# Altium project SCOM_SENSOR_HAT.PrjPcb
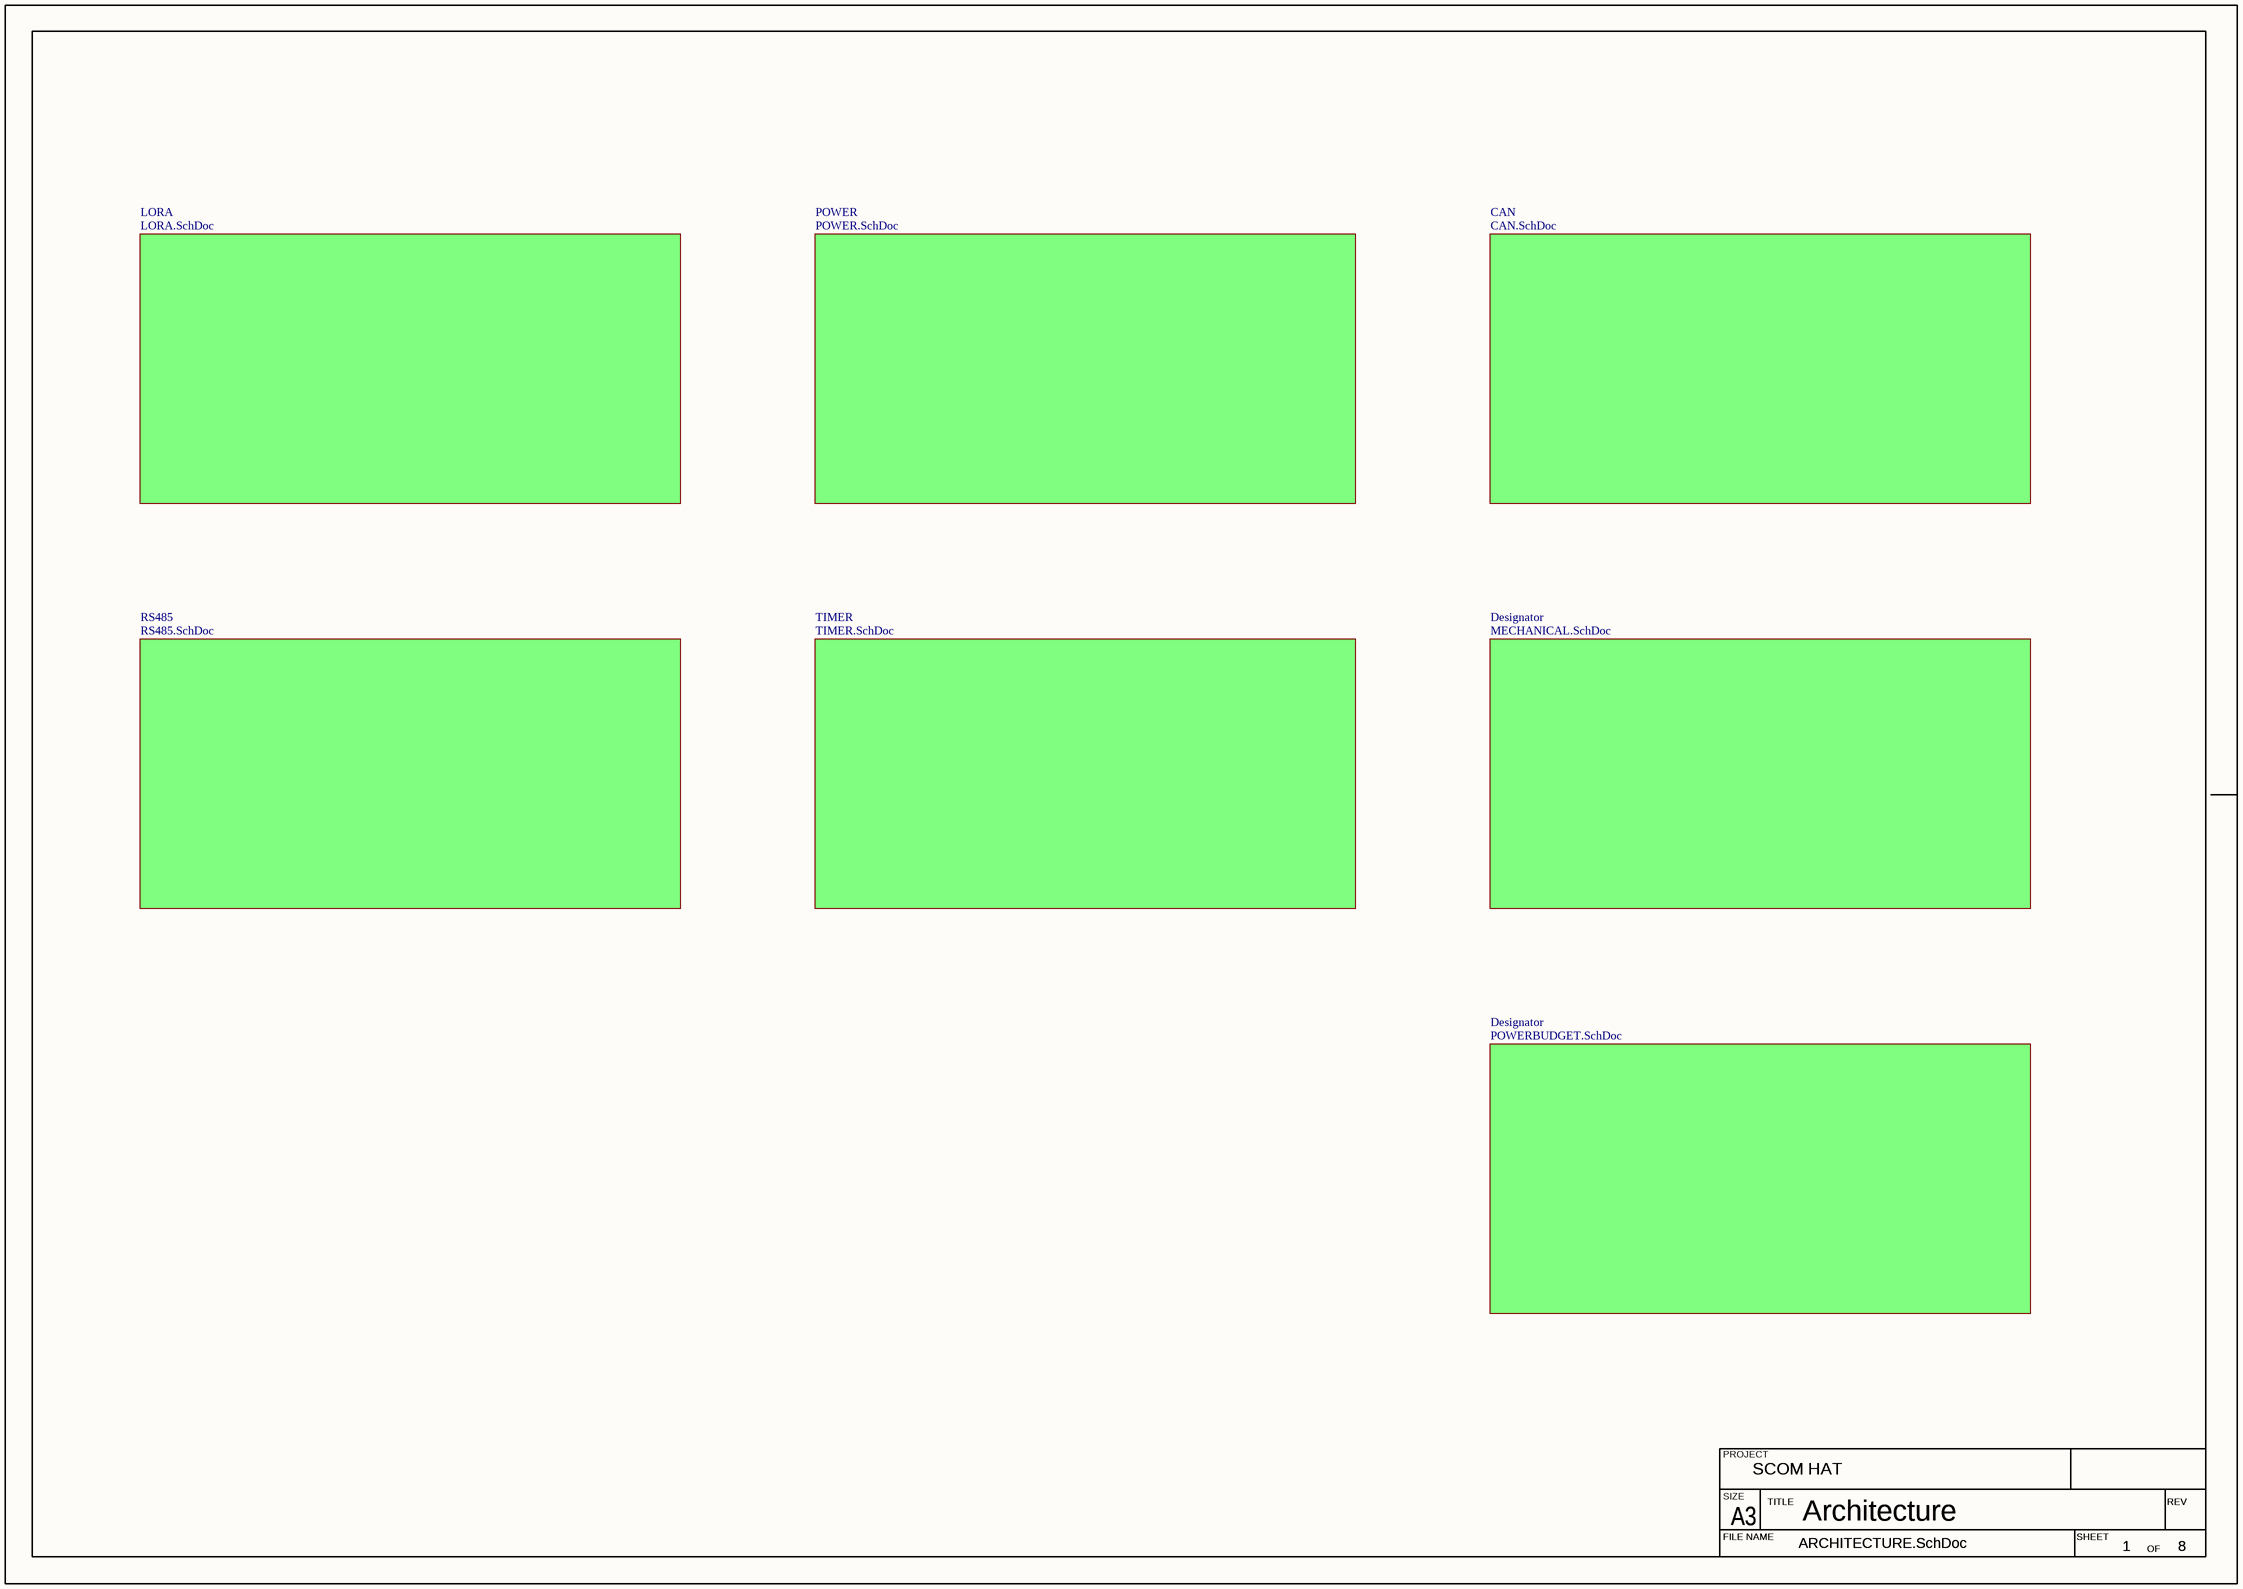
[diagram p0: ARCHITECTURE.SchDoc]
Project: SCOM HAT; Rev: 1.0; SheetTotal: 8
8 sheets, 74 parts. Net scope: global (net labels, ports and power ports of the same name join across sheets).
Board file: SCOM_SENSOR_HAT.PcbDoc
Sheets:
  ARCHITECTURE.SchDoc
    TIMER = TIMER.SchDoc
    POWER = POWER.SchDoc
    Designator = MECHANICAL.SchDoc
    RS485 = RS485.SchDoc
    LORA = LORA.SchDoc
    CAN = CAN.SchDoc
    Designator = POWERBUDGET.SchDoc

## Sheet ARCHITECTURE.SchDoc: Architecture
size 420 x 297 mm; Revision: 1.0; SheetNumber: 1

### Sub-sheets
CAN = CAN.SchDoc: no entries
Designator = MECHANICAL.SchDoc: no entries
Designator = POWERBUDGET.SchDoc: no entries
LORA = LORA.SchDoc: no entries
POWER = POWER.SchDoc: no entries
RS485 = RS485.SchDoc: no entries
TIMER = TIMER.SchDoc: no entries

### Notes on the sheet
- PROJECT
- SIZE
- FILE NAME
- A3
- TITLE
- SHEET
- OF
- REV

## Sheet TIMER.SchDoc: RV3028 Timer IC
size 420 x 297 mm; Revision: 1.0; SheetNumber: 3
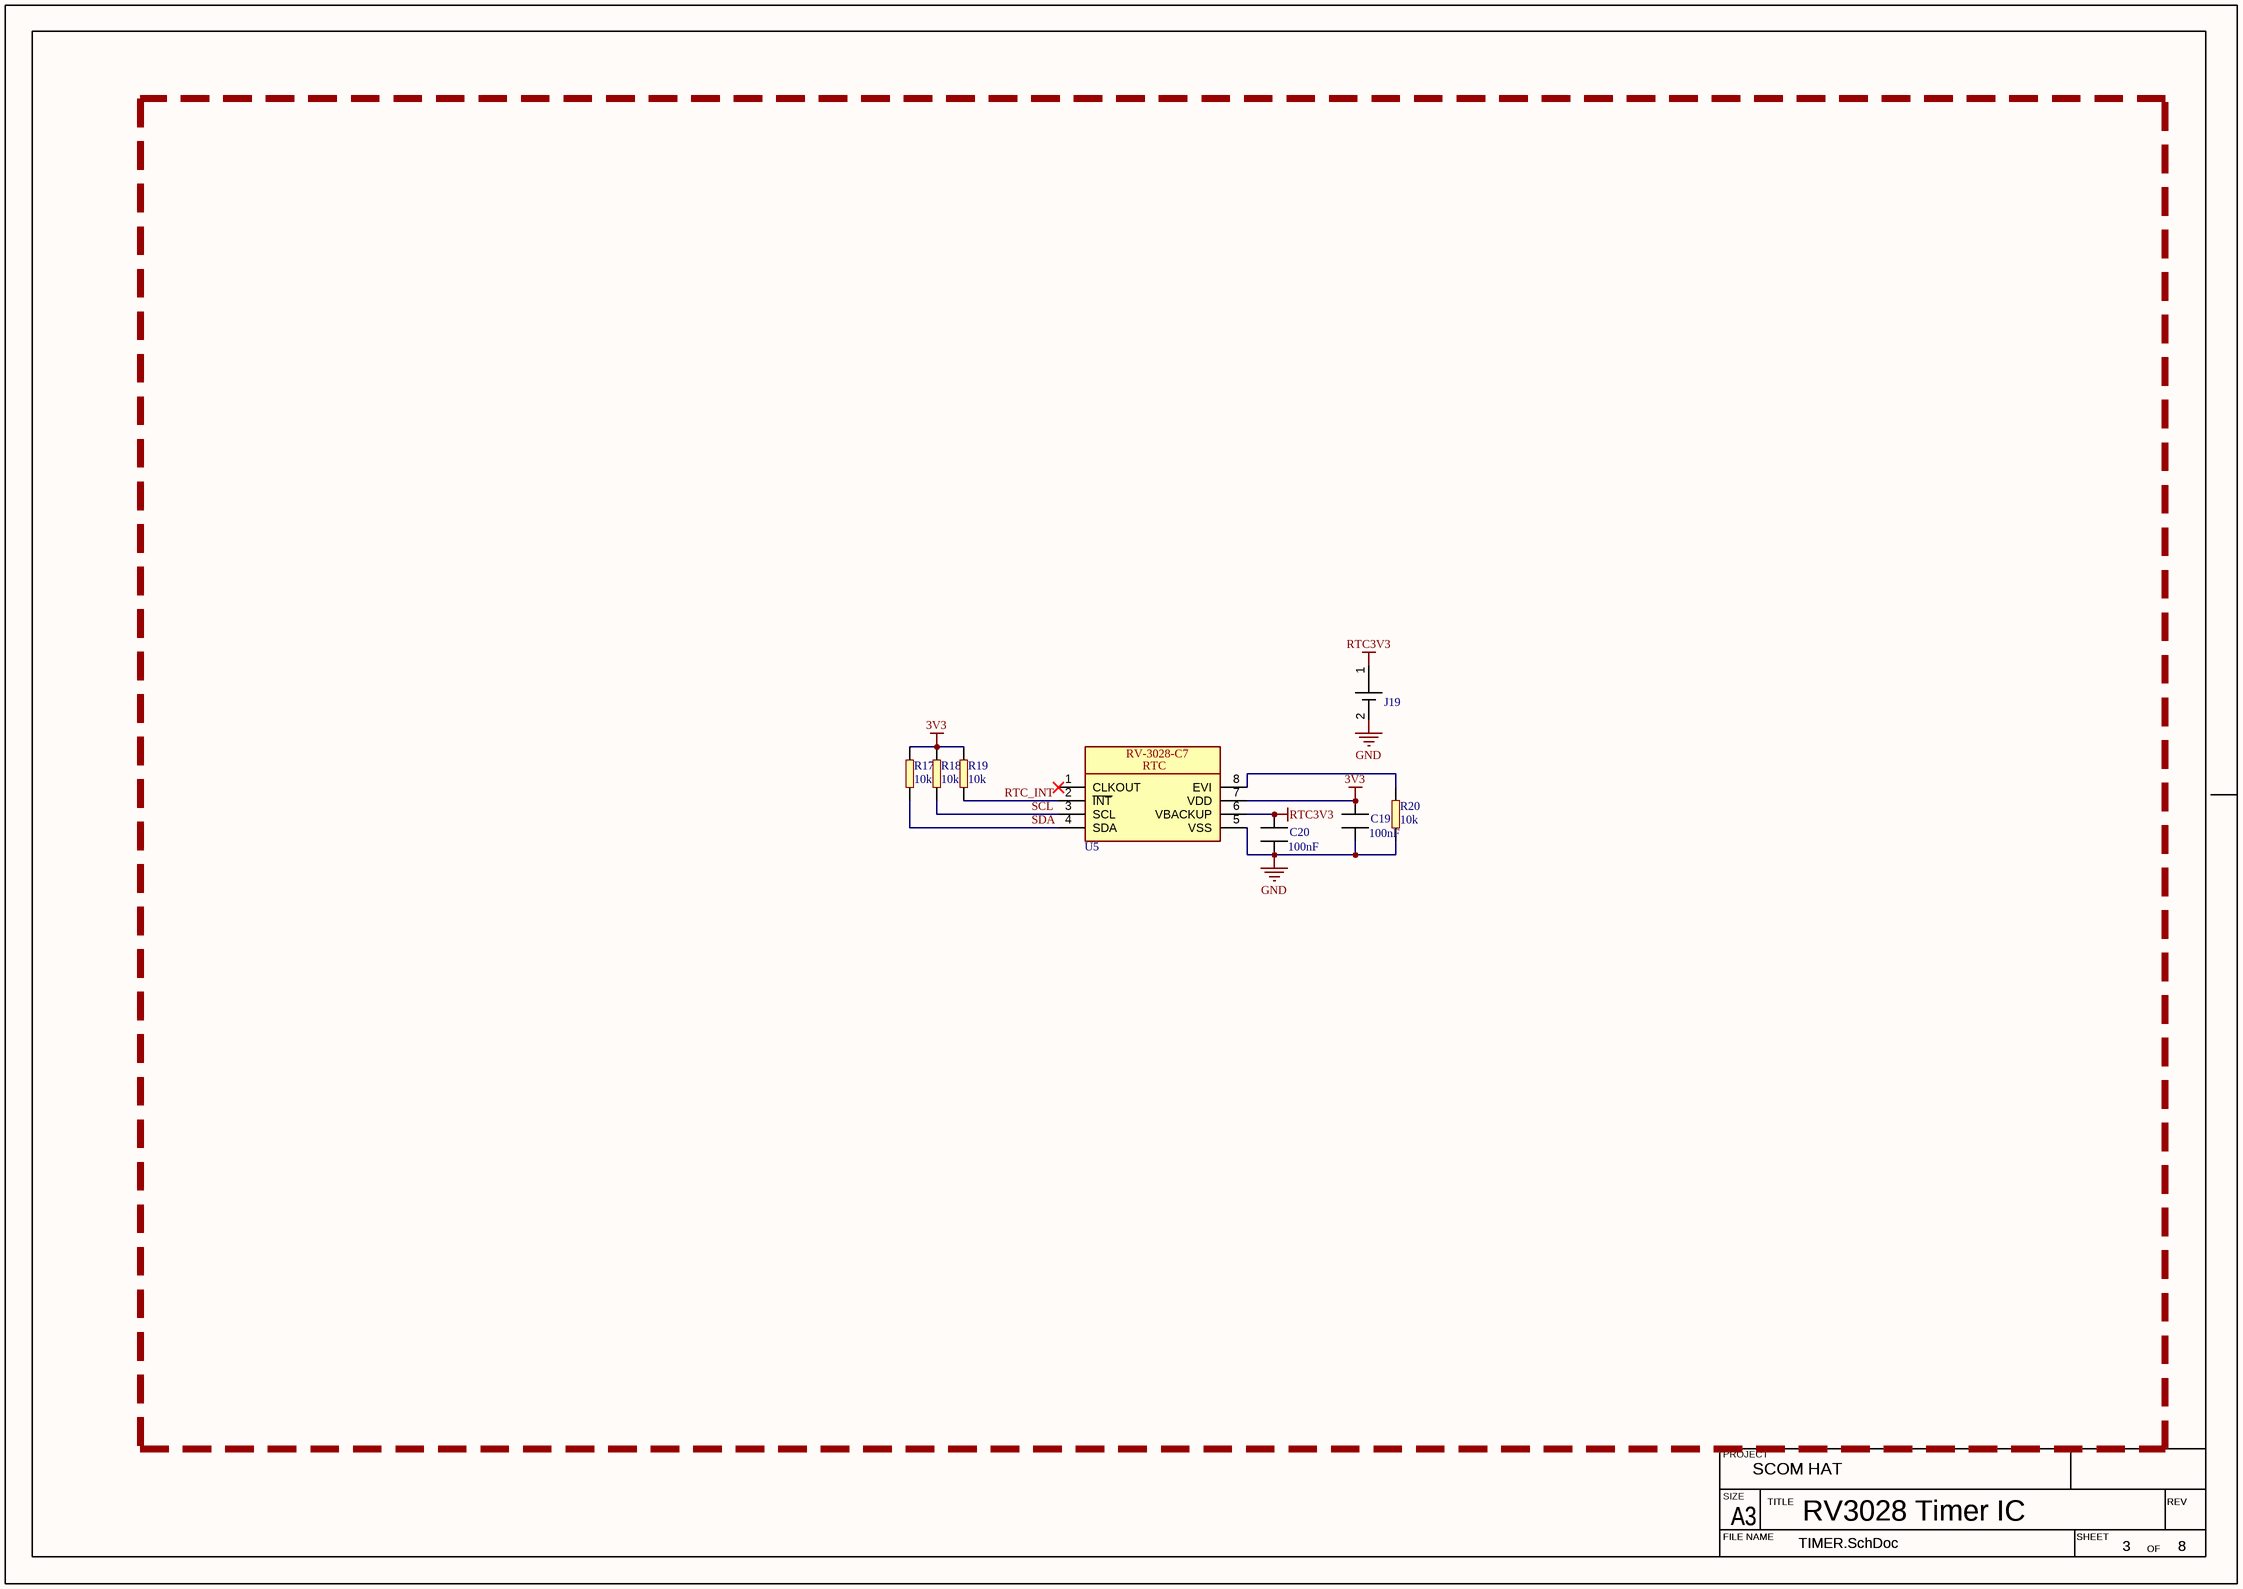
[diagram p1: TIMER.SchDoc]

### Parts
C19  value 100nF  [CAPC2012X13L]  (hidden comment: MLCC_0805)
C20  value 100nF  [CAPC2012X13L]  (hidden comment: MLCC_0805)
J19  CR1220-BH  [CR1220-BH]  (value not drawn)
R17  value 10k  [RES_0603]  (hidden comment: ERP_101-1)
R18  value 10k  [RES_0603]  (hidden comment: ERP_101-1)
R19  value 10k  [RES_0603]  (hidden comment: ERP_101-1)
R20  value 10k  [RES_0603]  (hidden comment: ERP_101-1)
U5  RV-3028-C7  [RV-3028-C7]  (value not drawn)

### Nets
3V3: C19.1 R17.2 R18.2 R19.2 U5.7(VDD)
GND: C19.2 C20.2 J19.2(-) R20.1 U5.5(VSS)
RTC3V3: C20.1 J19.1(+) U5.6(VBACKUP)
RTC_INT: R19.1 U5.2(~{INT})
SCL: R18.1 U5.3(SCL)
SDA: R17.1 U5.4(SDA)
NetR20_2: R20.2 U5.8(EVI)

Not connected (* = marked no-connect by the designer): U5 1(CLKOUT)*

### Notes on the sheet
- PROJECT
- SIZE
- FILE NAME
- A3
- TITLE
- SHEET
- OF
- REV
- (in symbol RV-3028-C7) RTC

### Library data of the parts
C19 C20 = MLCC_0805: 1uF 105 0805 (2012 metric) 50V X7R MLCC SMD; Package: 0805; Manufacturer 1: *; Manufacturer Part Number 1: *
J19 = CR1220-BH: BATTERY HOLDER COIN 12.5MM SMD; Manufacturer 1: Keystone Electronics; Value: *; Manufacturer Part Number 1: *
R17-R20 = RES_0603: Package: 0603; Manufacturer 1: *; Manufacturer Part Number 1: *; Supplier 1: *; Supplier Part Number 1: *; ERP: *
U5 = RV-3028-C7: IC RTC CLK/CALENDAR I2C 8SON; Manufacturer 1: Micro Crystal AG; Manufacturer Part Number 1: RV-3028-C7 32.768KHZ 1PPM-TA-QC; Value: *

## Sheet POWER.SchDoc: Power Supply
size 420 x 297 mm; Revision: 1.0; SheetNumber: 2; SheetTotal: 10
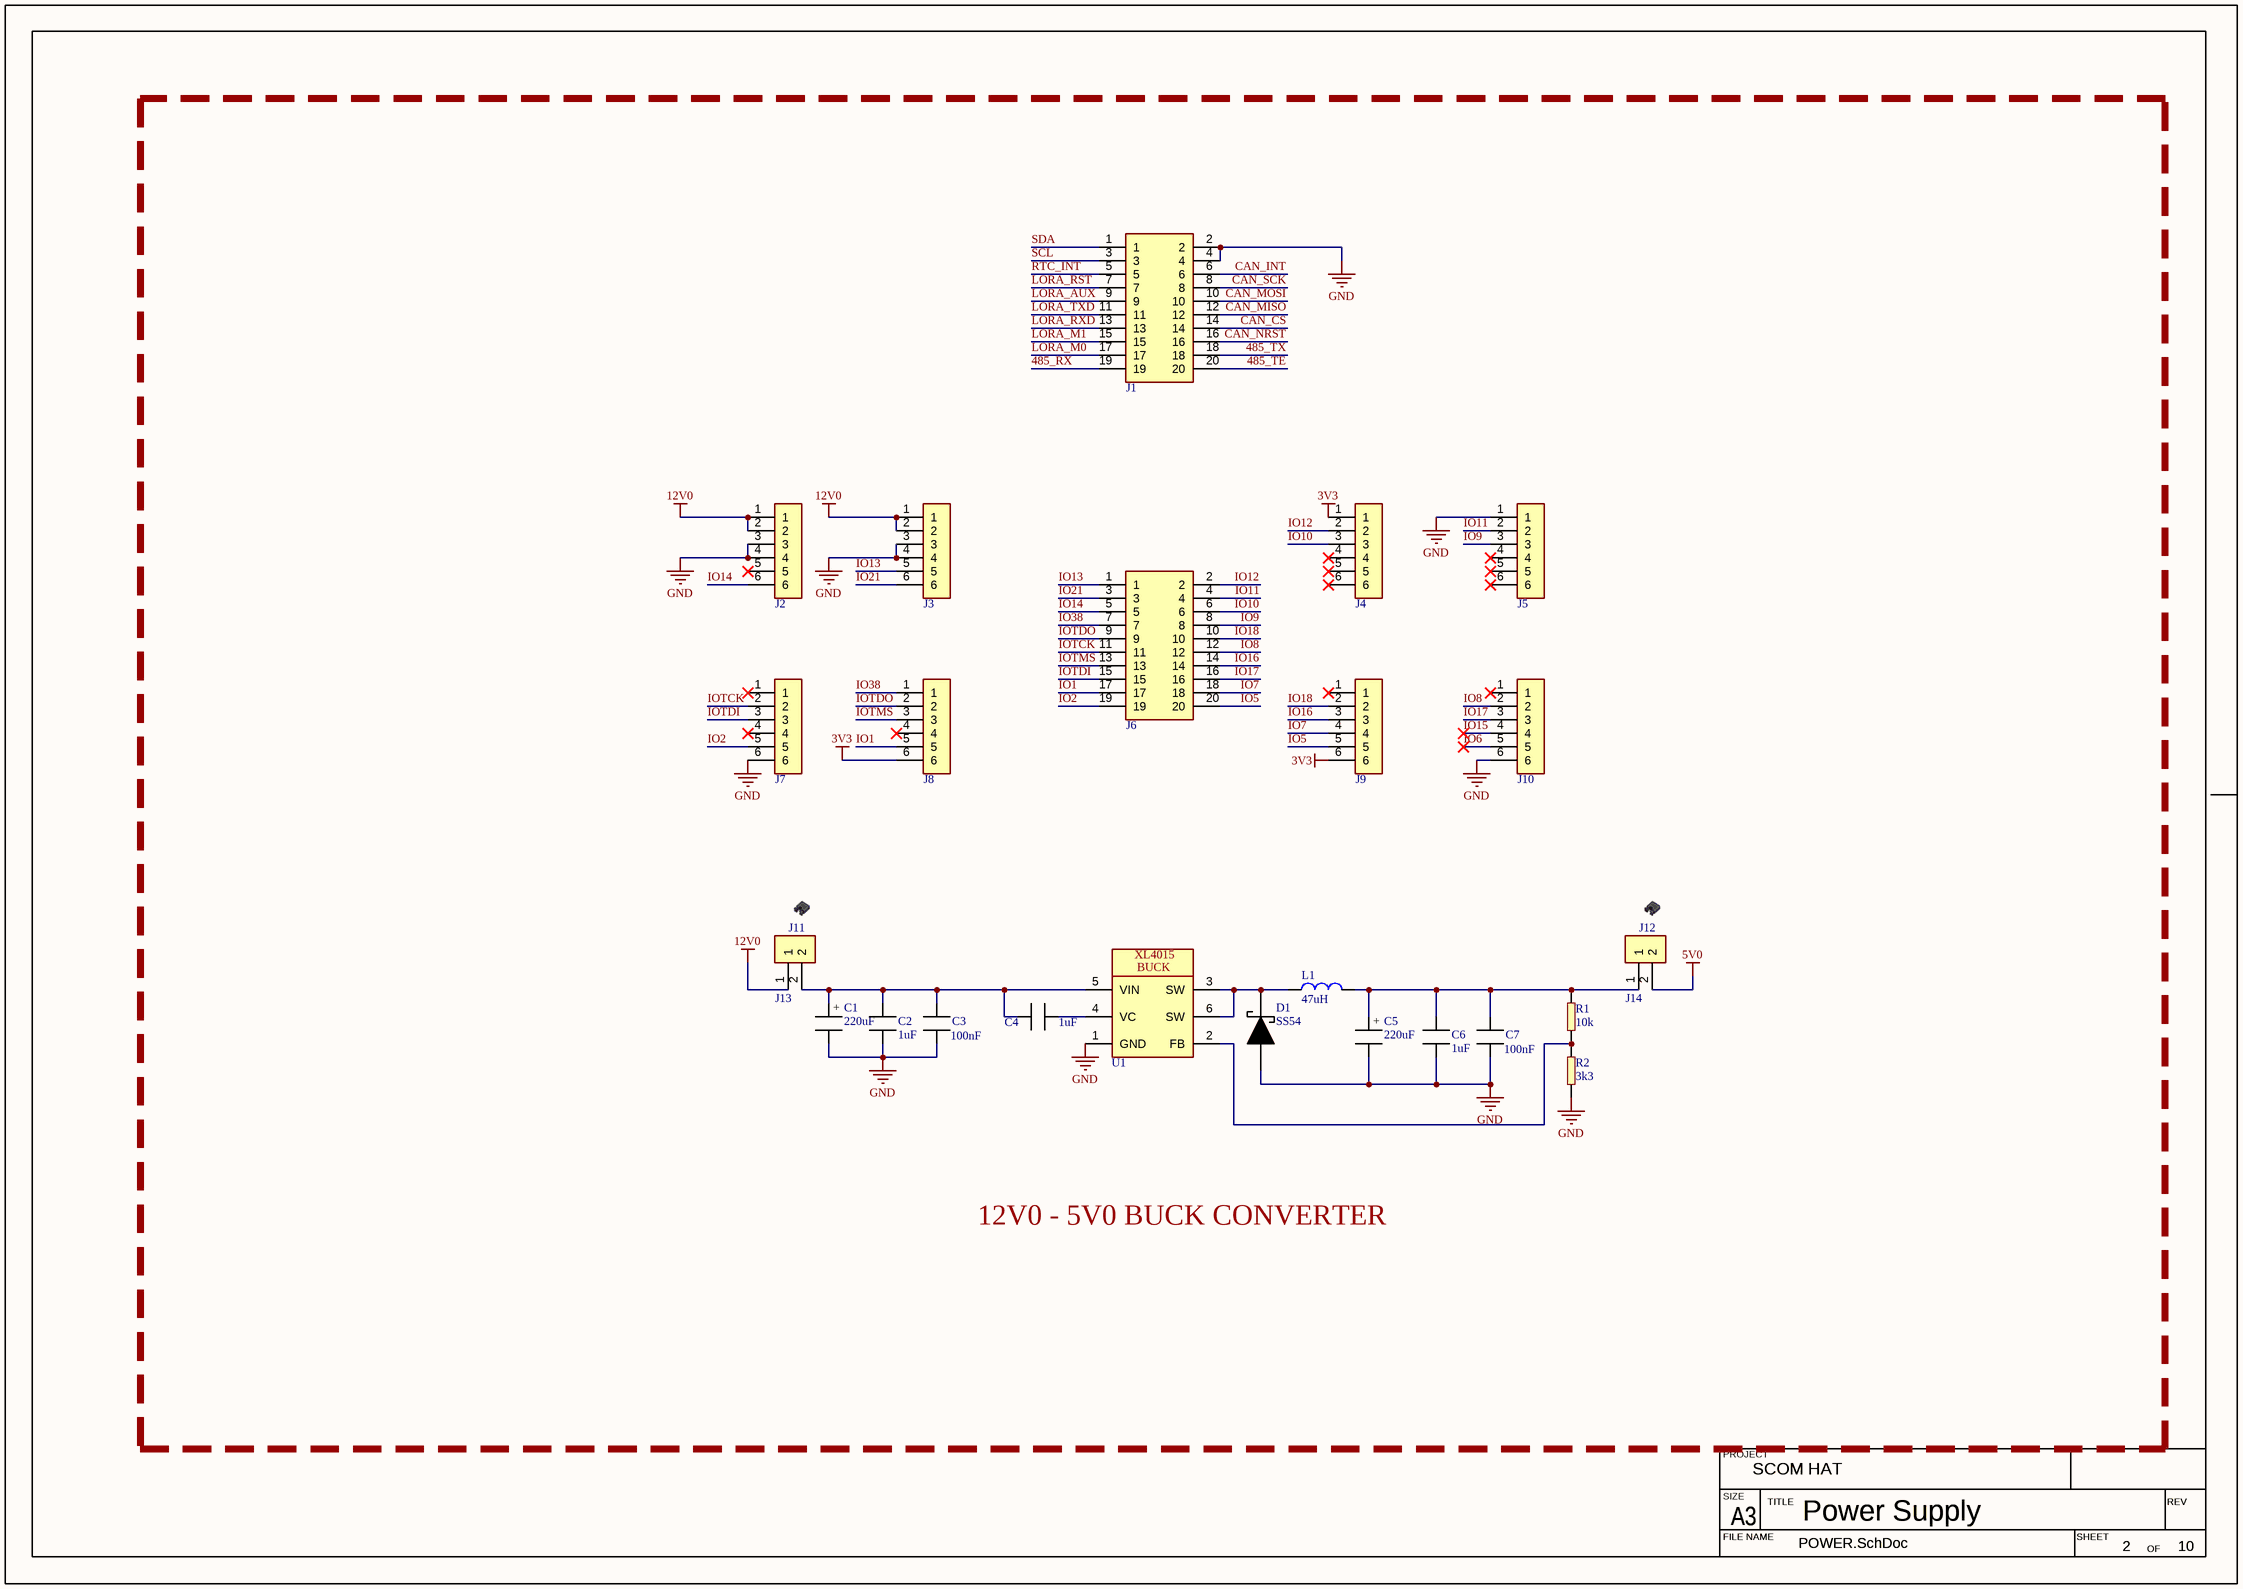
[diagram p2: POWER.SchDoc]

### Parts
C1  value 220uF  [CAP_D10_H16_P5 - Flat]  (hidden comment: ERP_102-2)
C2  value 1uF  [CAPC2012X13L]  (hidden comment: MLCC_0805)
C3  value 100nF  [CAPC2012X13L]  (hidden comment: MLCC_0805)
C4  value 1uF  [CAPC2012X13L]  (hidden comment: MLCC_0805)
C5  value 220uF  [CAP_D10_H16_P5 - Flat]  (hidden comment: ERP_102-2)
C6  value 1uF  [CAPC2012X13L]  (hidden comment: MLCC_0805)
C7  value 100nF  [CAPC2012X13L]  (hidden comment: MLCC_0805)
D1  value SS54  [DIOM6959X26L]  (hidden comment: ERP_104-3)
J1  20PX2R_M  [20PX2R_Male_THT_Shrouded]  (value not drawn)
J2  6PX1R_M  [6PX1R_M_STK20]  (value not drawn)
J3  6PX1R_M  [6PX1R_M_STK20]  (value not drawn)
J4  6PX1R_M  [6PX1R_M_STK20]  (value not drawn)
J5  6PX1R_M  [6PX1R_M_STK20]  (value not drawn)
J6  20PX2R_M  [20PX2R_Male_THT_Shrouded]  (value not drawn)
J7  6PX1R_M  [6PX1R_M_STK20]  (value not drawn)
J8  6PX1R_M  [6PX1R_M_STK20]  (value not drawn)
J9  6PX1R_M  [6PX1R_M_STK20]  (value not drawn)
J10  6PX1R_M  [6PX1R_M_STK20]  (value not drawn)
J11  Jumper Cap  (value not drawn)  (mechanical)
J12  Jumper Cap  (value not drawn)  (mechanical)
J13  2PX1R  [2PX1R]  (value not drawn)
J14  2PX1R  [2PX1R]  (value not drawn)
L1  value 47uH  [IND_1212]  (hidden comment: ERP_103-3)
R1  value 10k  [RES_0603]  (hidden comment: ERP_101-1)
R2  value 3k3  [RES_0603]  (hidden comment: ERP_101-1)
U1  XL4015  [XL4015]  (value not drawn)

### Blocks framed on the sheet
12V0 - 5V0 BUCK CONVERTER: C1-C7 D1 J1-J14 L1 R1 R2 U1

### Nets
3V3: J4.1 J8.6 J9.6
5V0: J14.2
12V0: J2.1 J2.2 J3.1 J3.2 J13.1
GND: C1.2 C2.2 C3.2 C5.2 C6.2 C7.2 D1.2(A) J1.2 J1.4 J2.3 J2.4 J3.3 J3.4 J5.1 J7.6 J10.6 R2.2 U1.1(GND)
485_RX: J1.19
485_TE: J1.20
485_TX: J1.18
CAN_CS: J1.14
CAN_INT: J1.6
CAN_MISO: J1.12
CAN_MOSI: J1.10
CAN_NRST: J1.16
CAN_SCK: J1.8
IO1: J6.17 J8.5
IO2: J6.19 J7.5
IO5: J6.20 J9.5
IO6: J10.5
IO7: J6.18 J9.4
IO8: J6.12 J10.2
IO9: J5.3 J6.8
IO10: J4.3 J6.6
IO11: J5.2 J6.4
IO12: J4.2 J6.2
IO13: J3.5 J6.1
IO14: J2.6 J6.5
IO15: J10.4
IO16: J6.14 J9.3
IO17: J6.16 J10.3
IO18: J6.10 J9.2
IO21: J3.6 J6.3
IO38: J6.7 J8.1
IOTCK: J6.11 J7.2
IOTDI: J6.15 J7.3
IOTDO: J6.9 J8.2
IOTMS: J6.13 J8.3
LORA_AUX: J1.9
LORA_M0: J1.17
LORA_M1: J1.15
LORA_RST: J1.7
LORA_RXD: J1.13
LORA_TXD: J1.11
RTC_INT: J1.5
SCL: J1.3
SDA: J1.1
NetC1_1: C1.1 C2.1 C3.1 C4.1 J13.2 U1.5(VIN)
NetC4_2: C4.2 U1.4(VC)
NetC5_1: C5.1 C6.1 C7.1 J14.1 L1.2 R1.1
NetD1_1: D1.1(C) L1.1 U1.3(SW) U1.6(SW)
NetR1_2: R1.2 R2.1 U1.2(FB)

Not connected (* = marked no-connect by the designer): J2 5*; J4 4* 5* 6*; J5 4* 5* 6*; J7 1* 4*; J8 4*; J9 1*; J10 1*

### Notes on the sheet
- PROJECT
- SIZE
- FILE NAME
- A3
- TITLE
- SHEET
- OF
- REV
- (in symbol CAP_D10_H16_P5) +
- (in symbol XL4015) BUCK

### Library data of the parts
C1 C5 = CAP_D10_H16_P5: Electrolytic Capacitor Through Hole D10 P5.0; Package: 10X5; Manufacturer 1: *; Manufacturer Part Number 1: *; Supplier 1: *
C2-C4 C6 C7 = MLCC_0805: Chip Capacitor, 2-Leads, Body 2.00x1.25mm, IPC High Density; Package: 0805; Manufacturer 1: *; Manufacturer Part Number 1: *
D1 = SS54: Supplier Part Number 1: *; Supplier  1: *; Package: SMC; Manufacturer Part Number 1: *; Manufacturer 1: *; ERP: *
J1 J6 = 20PX2R_M: Connector Header Surface Mount 20 position 0.100" (2.54mm); Manufacturer 1: CNC Tech; Value: *; Manufacturer Part Number 1: *
J2-J5 J7-J10 = 6PX1R_M: 6PX1R Male Header; Value: *; Manufacturer 1: *; Manufacturer Part Number 1: *
J11 J12 = Jumper Cap: 2 Pin Jumper Cap P2.54; Manufacturer Part Number 1: *; Manufacturer 1: *; Value: *
L1 = IND_1212: Manufacturer 1: Würth Elektronik; Manufacturer Part Number 1: *
R1 = RES_0603: Package: 0603; Manufacturer 1: *; Manufacturer Part Number 1: *
R2 = RES_0603: Manufacturer Part Number 1: 560112116003; Package: 0603; Manufacturer 1: *
U1 = XL4015: 5A 180KHz 36V Buck DC to DC Converter; Manufacturer 1: XLSemi; Manufacturer Part Number 1: XL4015E1; Value: *

## Sheet MECHANICAL.SchDoc: MECHANICAL
size 420 x 297 mm; Revision: 1.0; SheetNumber: 7

### Notes on the sheet
- PROJECT
- SIZE
- FILE NAME
- A3
- TITLE
- SHEET
- OF
- REV

## Sheet RS485.SchDoc: RS485 Module
size 420 x 297 mm; Revision: 1.0; SheetNumber: 6
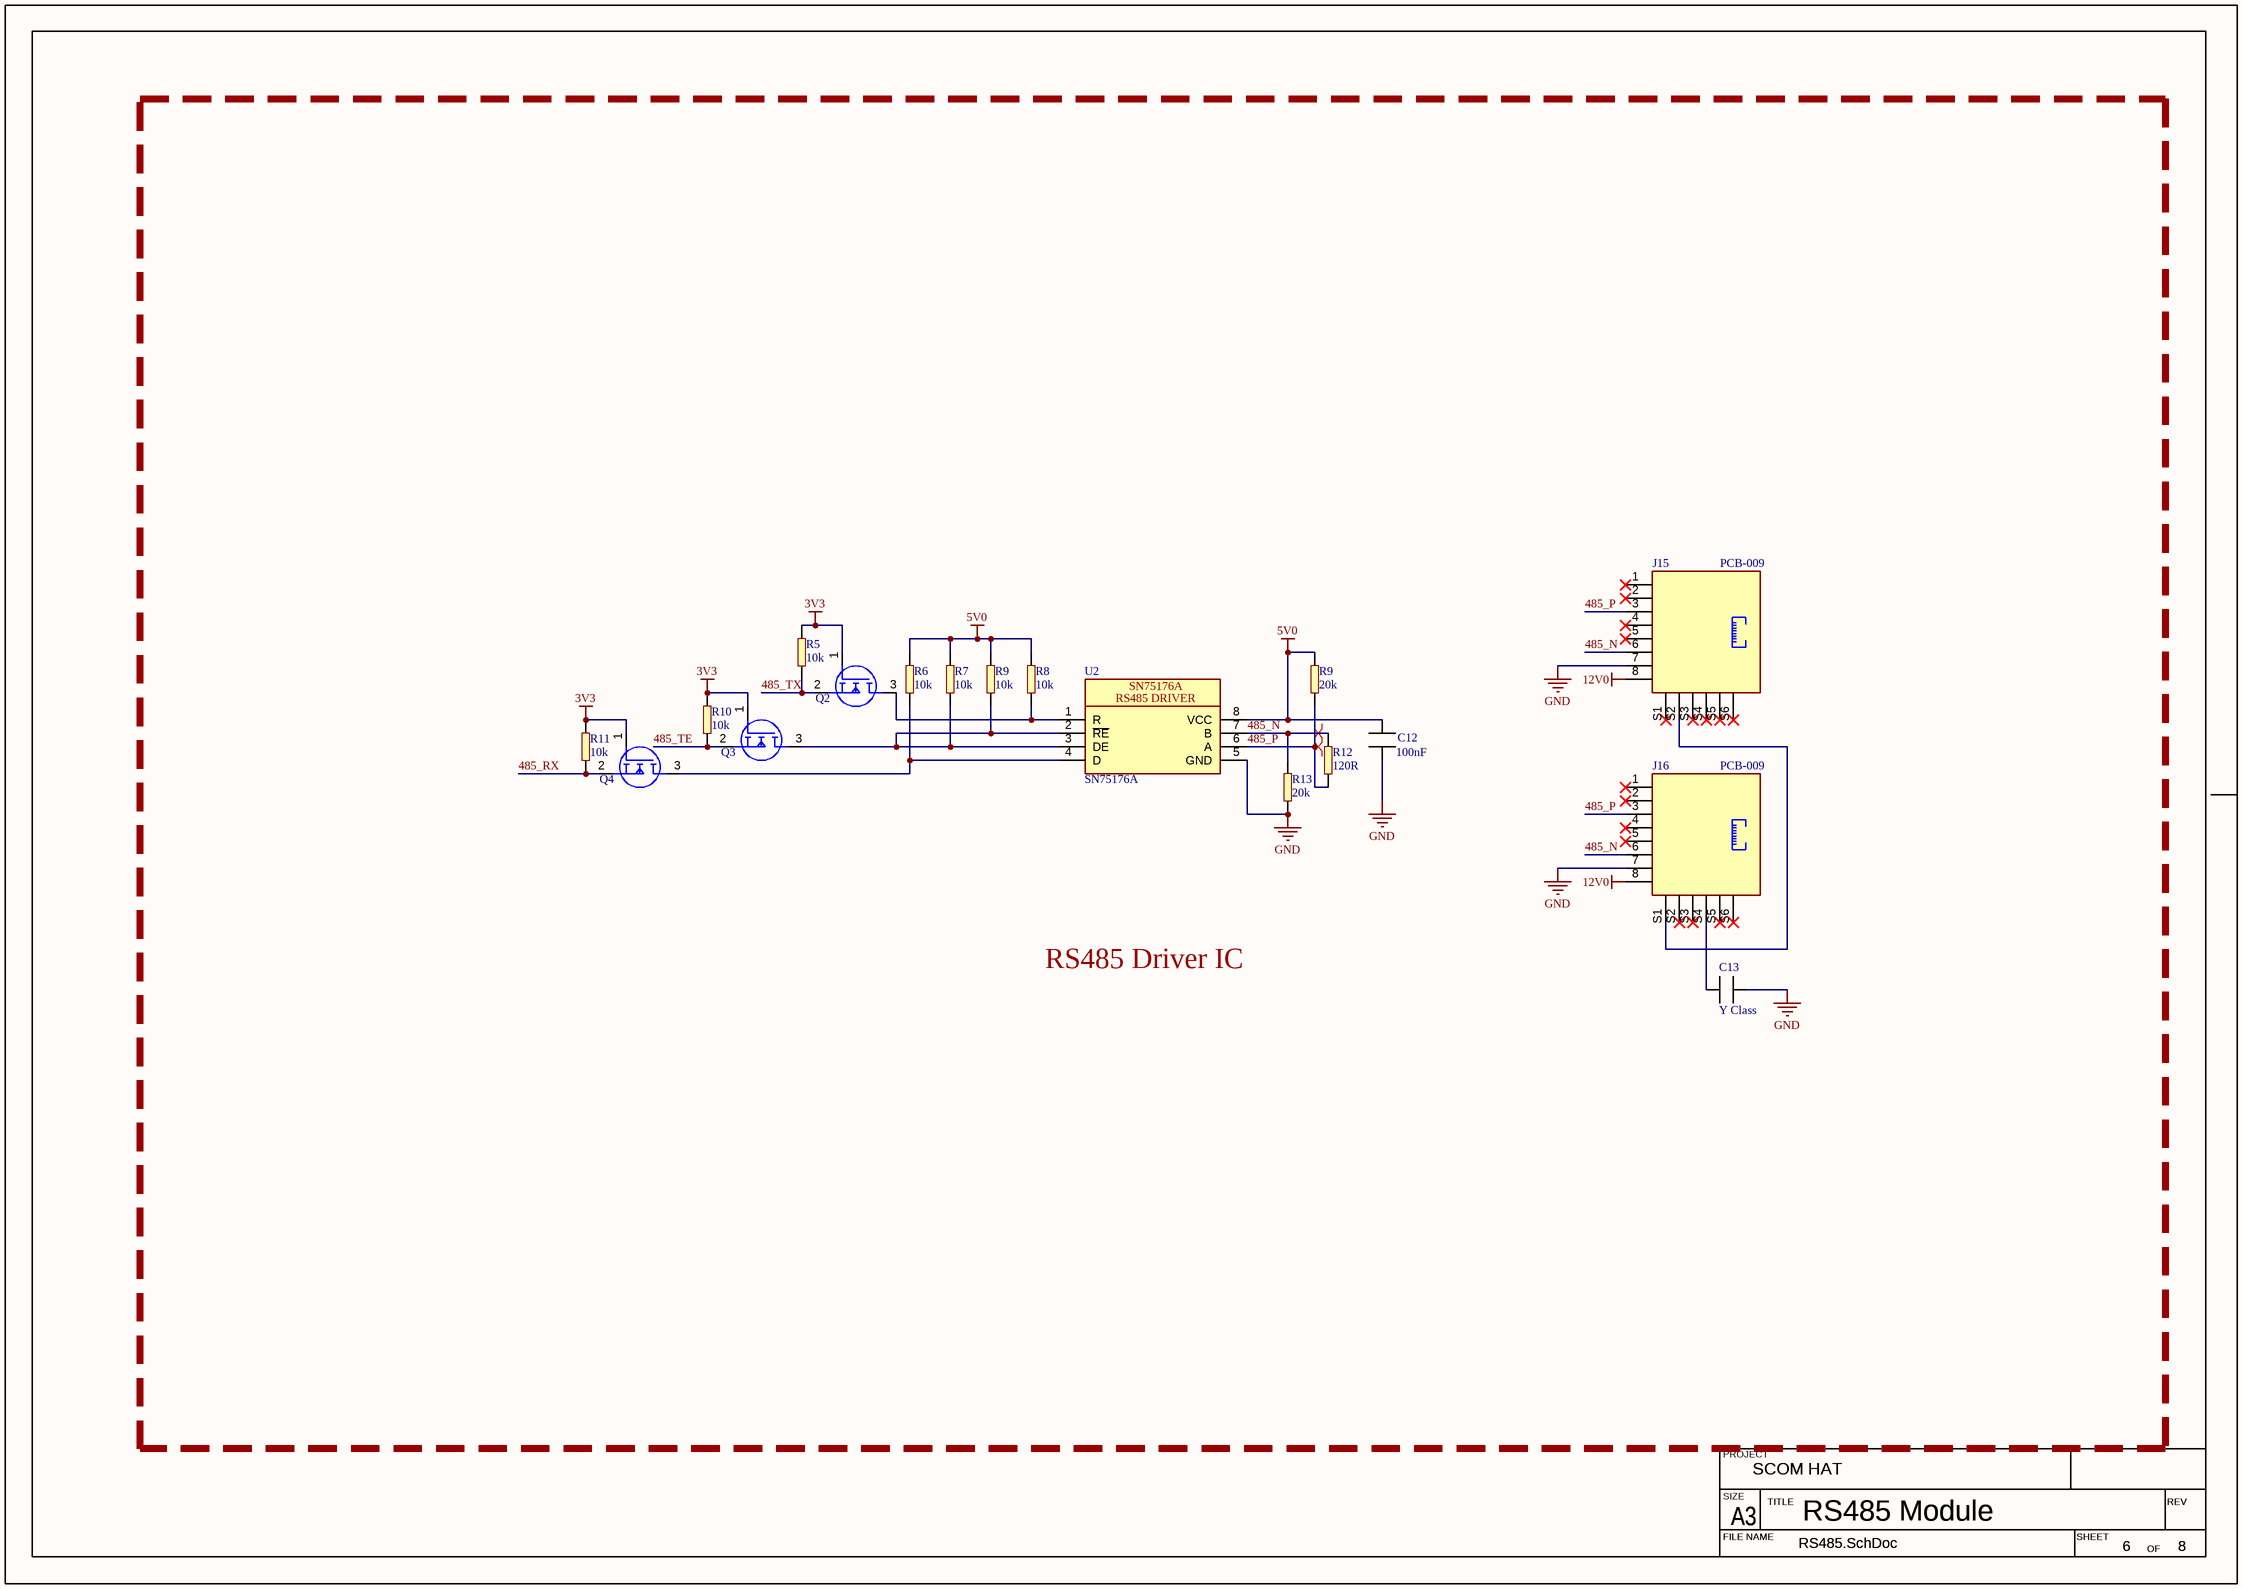
[diagram p3: RS485.SchDoc]

### Parts
(Parts that share a designator on the sheet are numbered #1, #2 ... from top to bottom, then left to right.)
C12  value 100nF  [CAPC2012X13L]  (hidden comment: MLCC_0805)
C13  value Y Class  [VY1222M43Y5UC63V0]  (hidden comment: VY1)
J15  value PCB-009  [PCB-009]  (hidden comment: ERP_148-3)
J16  value PCB-009  [PCB-009]  (hidden comment: ERP_148-3)
Q2  BSS138L  [BSS138L]  (value not drawn)
Q3  BSS138L  [BSS138L]  (value not drawn)
Q4  BSS138L  [BSS138L]  (value not drawn)
R5  value 10k  [RES_0603]  (hidden comment: ERP_101-1)
R6  value 10k  [RES_0603]  (hidden comment: ERP_101-1)
R7  value 10k  [RES_0603]  (hidden comment: ERP_101-1)
R8  value 10k  [RES_0603]  (hidden comment: ERP_101-1)
R9#1  value 10k  [RES_0603]  (hidden comment: ERP_101-1)  (graphical)
R9#2  value 20k  [RES_0603]  (hidden comment: ERP_101-1)
R10  value 10k  [RES_0603]  (hidden comment: ERP_101-1)
R11  value 10k  [RES_0603]  (hidden comment: ERP_101-1)
R12  value 120R  [RES_0603]  (hidden comment: ERP_101-1)
R13  value 20k  [RES_0603]  (hidden comment: ERP_101-1)
U2  SN75176A  [SN75176A]

### Blocks framed on the sheet
RS485 Driver IC: C12 C13 J15 J16 Q2-Q4 R5-R8 R9#1 R9#2 R10-R13 U2

### Nets
3V3: Q2.1(G) Q3.1(G) Q4.1(G) R5.1 R10.1 R11.1
5V0: C12.1 R6.1 R7.1 R8.1 R9#1.1 R9#2.1 U2.8(VCC)
12V0: J15.8 J16.8
GND: C12.2 C13.2 J15.7 J16.7 R13.2 U2.5(GND)
485_N: J15.6 J16.6 R12.1 R13.1 U2.7(B)
485_P: J15.3 J16.3 R9#2.2 R12.2 U2.6(A)
485_RX: Q4.2(S) R11.2
485_TE: Q3.2(S) R10.2
485_TX: Q2.2(S) R5.2
NetC13_1: C13.1 J16.S4
NetJ15_S2: J15.S2 J16.S1
NetQ2_3: Q2.3(D) R8.2 U2.1(R)
NetQ3_3: Q3.3(D) R7.2 R9#1.2 U2.2(~{RE}) U2.3(DE)
NetQ4_3: Q4.3(D) R6.2 U2.4(D)

Not connected (* = marked no-connect by the designer): J15 1* 2* 4* 5* S1* S3* S4* S5* S6*; J16 1* 2* 4* 5* S2* S3* S5* S6*

### Layout directives
differential pair; differential pair class 485_120R; rule Differential Pairs Routing [Pref Gap = 0.254mm    Min Gap  = 0.254mm    Max Gap  = 0.254mmPref Width = 0.42mm    Min Width  = 0.42mm    Max Width  = 0.42mm]: 485_N
differential pair; rule Differential Pairs Routing [Pref Gap = 0.254mm    Min Gap  = 0.254mm    Max Gap  = 0.254mmPref Width = 0.42mm    Min Width  = 0.42mm    Max Width  = 0.42mm]; differential pair class 485_120R: 485_P

### Notes on the sheet
- PROJECT
- SIZE
- FILE NAME
- A3
- TITLE
- SHEET
- OF
- REV
- (in symbol SN75176A) RS485 DRIVER

### Library data of the parts
C12 = MLCC_0805: as C2 on sheet POWER; Package: 0805; Manufacturer 1: *; Manufacturer Part Number 1: *
C13 = VY1: Ceramic Capacitor Y5U (E) Radial, Disc; Manufacturer 1: *; Manufacturer Part Number 1: *
J15 J16 = RJ45_Top_Entry: PCB-009 Robu; Manufacturer Part Number 1: *; Manufacturer 1: *; Supplier Part Number 1: *; Supplier 1: *; ERP: *; Package: 8P8C
Q2-Q4 = BSS138L: NMOS; Manufacturer Part Number 1: BSS138LT1G; Manufacturer 1: ON; Value: *; ERP: *; Supplier Part Number 1: *; Supplier 1: *; Package: SOT23-3
R5-R8 R9#1 R10 R11 = RES_0603: Package: 0603; Manufacturer 1: *; Manufacturer Part Number 1: *
R9#2 R12 R13 = RES_0603: Manufacturer Part Number 1: 560112116003; Package: 0603; Manufacturer 1: *
U2 = SN75176A: RS485/422 Driver IC; Manufacturer 1: Sunrom; Manufacturer Part Number 1: 3875; Value: SN75176A

## Sheet LORA.SchDoc: EByte LoRa Module
size 420 x 297 mm; Revision: 1.0; SheetNumber: 3
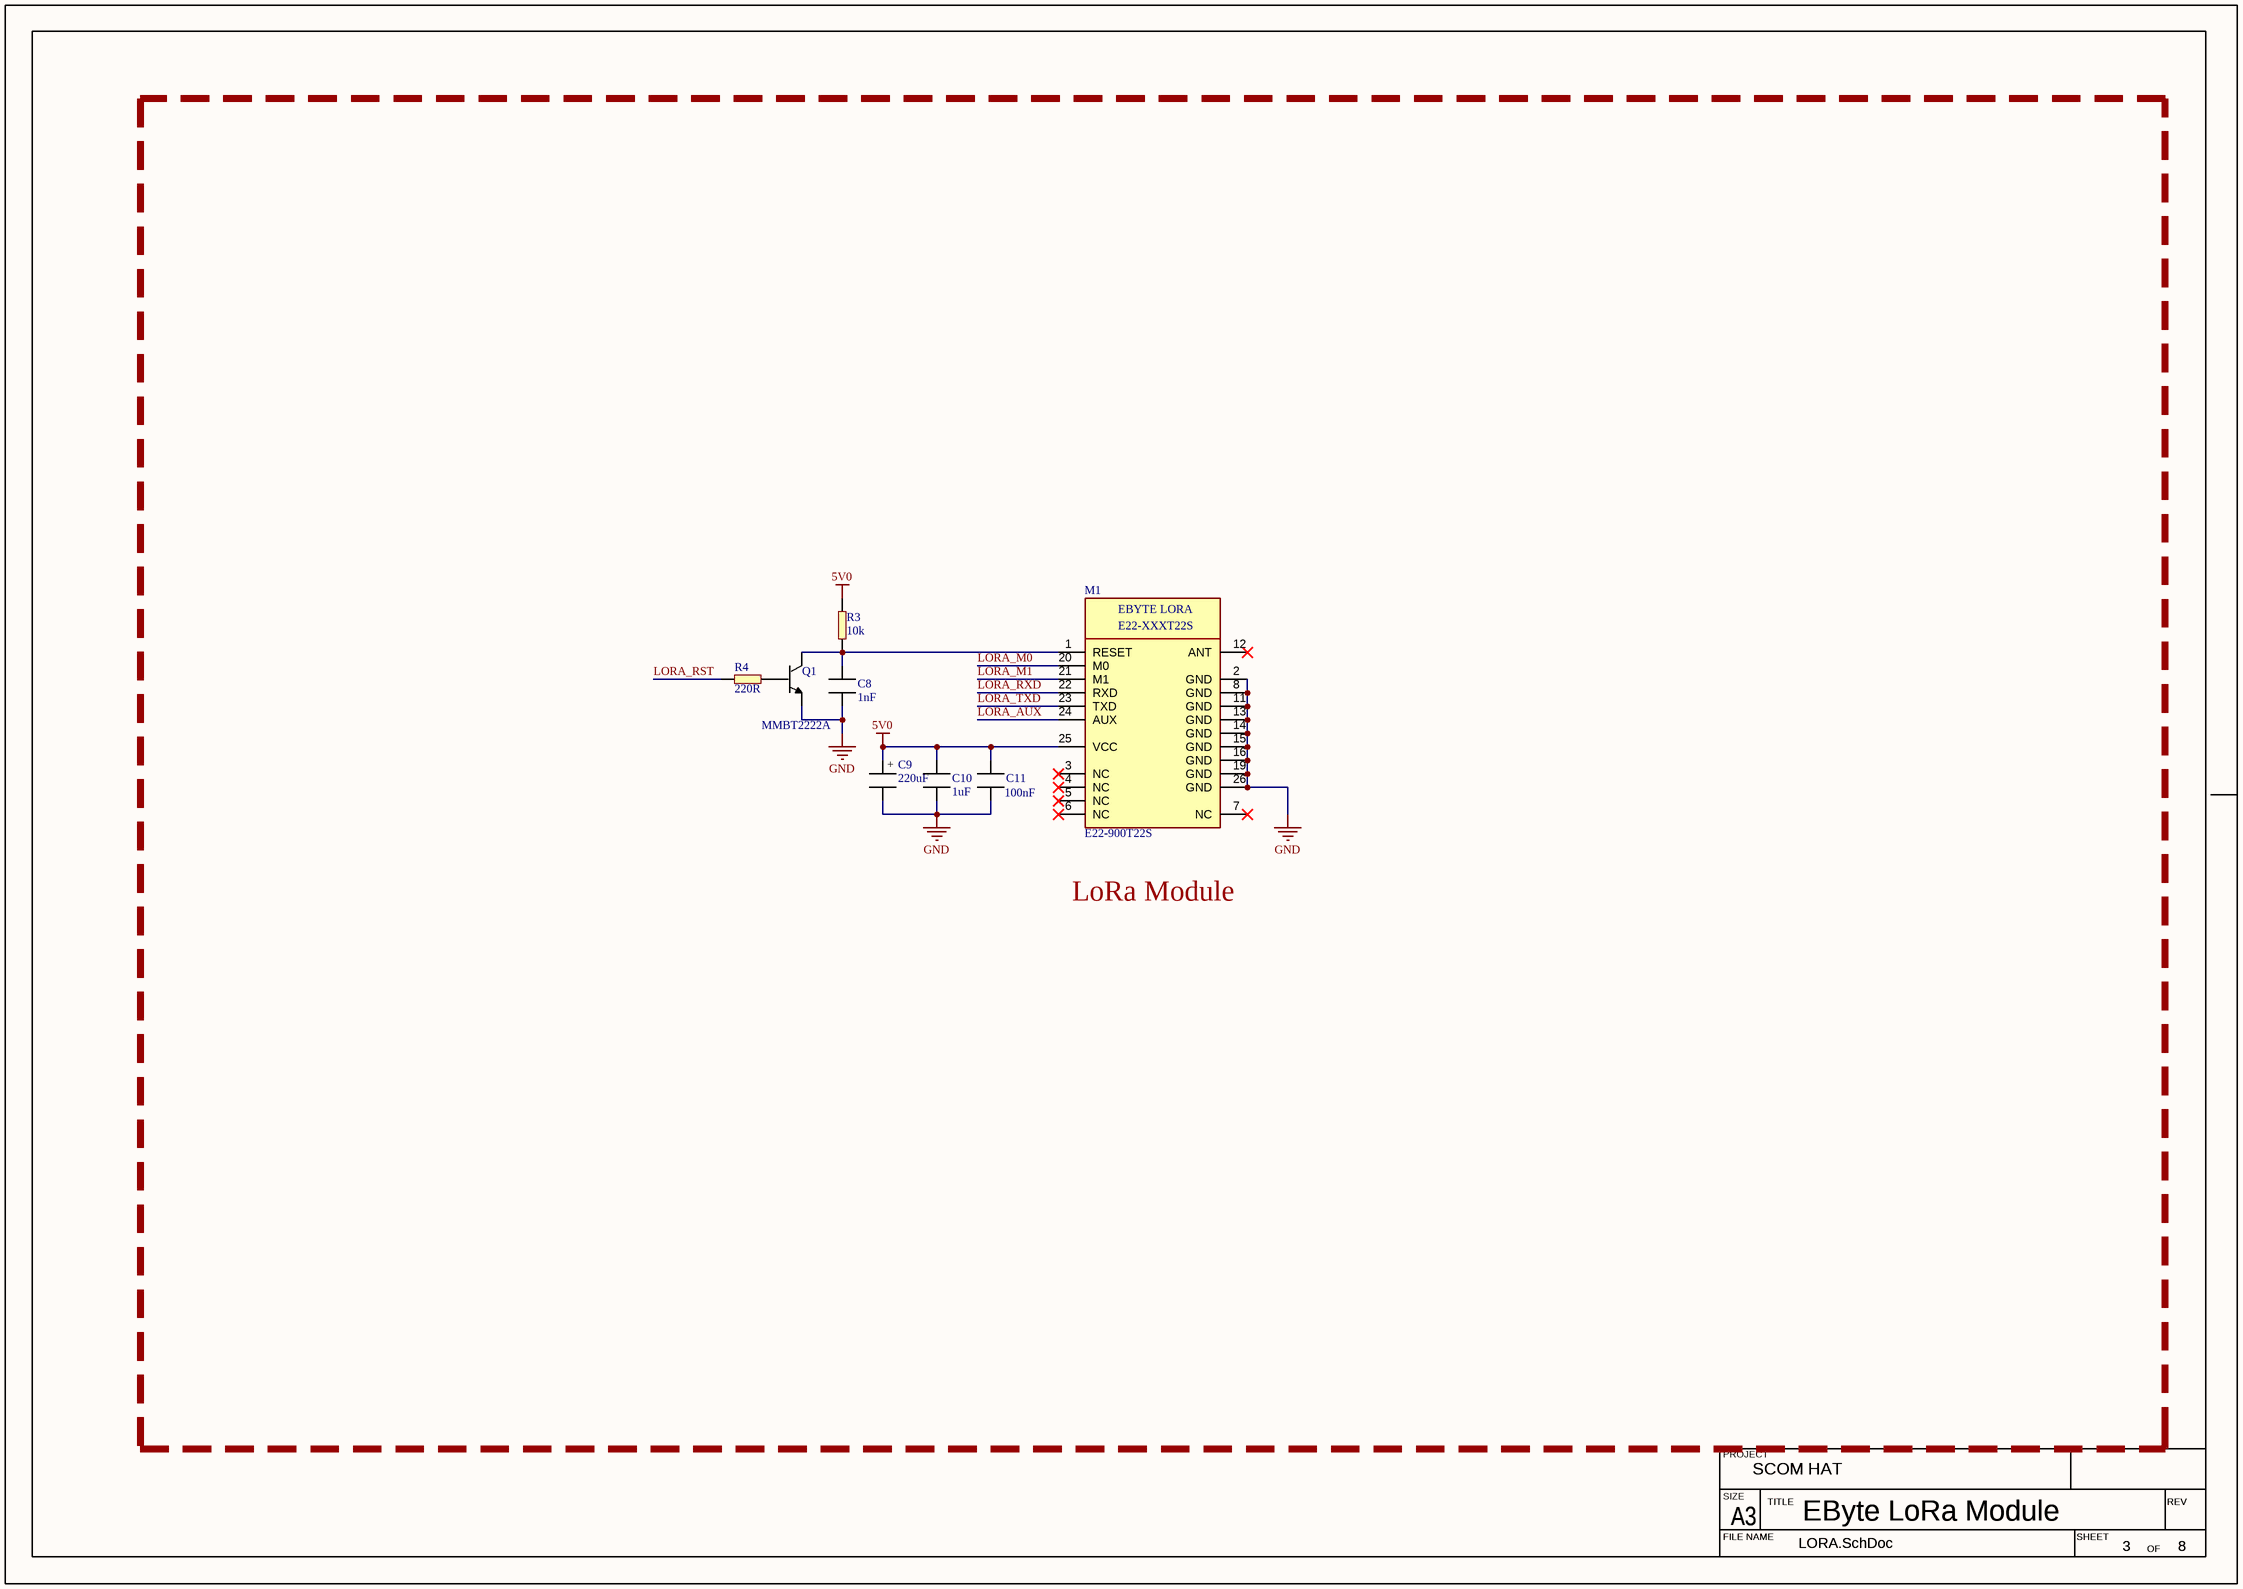
[diagram p4: LORA.SchDoc]

### Parts
C8  value 1nF  [CAPC2012X13L]  (hidden comment: MLCC_0805)  (no BOM)
C9  value 220uF  [CAP_D10_H16_P5 - Flat]  (hidden comment: ERP_102-2)
C10  value 1uF  [CAPC2012X13L]  (hidden comment: MLCC_0805)
C11  value 100nF  [CAPC2012X13L]  (hidden comment: MLCC_0805)
M1  value E22-900T22S  [E22-XXXT22S]  (hidden comment: E22-XXXT22S)
Q1  value MMBT2222A  [MMBT2222]  (hidden comment: ERP_105-1)
R3  value 10k  [RES_0603]  (hidden comment: ERP_101-1)
R4  value 220R  [RES_0603]  (hidden comment: ERP_101-1)

### Nets
5V0: C9.1 C10.1 C11.1 M1.25(VCC) R3.2
GND: C8.2 C9.2 C10.2 C11.2 M1.2(GND) M1.8(GND) M1.11(GND) M1.13(GND) M1.14(GND) M1.15(GND) M1.16(GND) M1.19(GND) M1.26(GND) Q1.2
LORA_AUX: M1.24(AUX)
LORA_M0: M1.20(M0)
LORA_M1: M1.21(M1)
LORA_RST: R4.2
LORA_RXD: M1.22(RXD)
LORA_TXD: M1.23(TXD)
NetC8_1: C8.1 M1.1(RESET) Q1.3 R3.1
NetQ1_1: Q1.1 R4.1

Not connected (* = marked no-connect by the designer): M1 3(NC)* 4(NC)* 5(NC)* 6(NC)* 7(NC)* 12(ANT)*

### Notes on the sheet
- LoRa Module
- PROJECT
- SIZE
- FILE NAME
- A3
- TITLE
- SHEET
- OF
- REV
- (in symbol CAP_D10_H16_P5) +
- (in symbol E22-XXXT22S) EBYTE LORA

### Library data of the parts
C8 C10 C11 = MLCC_0805: as C2 on sheet POWER; Package: 0805; Manufacturer 1: *; Manufacturer Part Number 1: *
C9 = CAP_D10_H16_P5: as C1 on sheet POWER; Package: 10X5; Manufacturer 1: *; Manufacturer Part Number 1: *; Supplier 1: *
M1 = E22-XXXT22S: E22 EByte LoRa Module; Manufacturer 1: *; Manufacturer Part Number 1: *
Q1 = MMBT2222: MMBT2222A; ERP: *; Suuplier Part Number 1: *; Supplier 1: *; Manufacturer Part Number 1: *; Manufacturer 1: *; Package: SOT23
R3 R4 = RES_0603: Package: 0603; Manufacturer 1: *; Manufacturer Part Number 1: *

## Sheet CAN.SchDoc: MCP2515 CAN BUS
size 420 x 297 mm
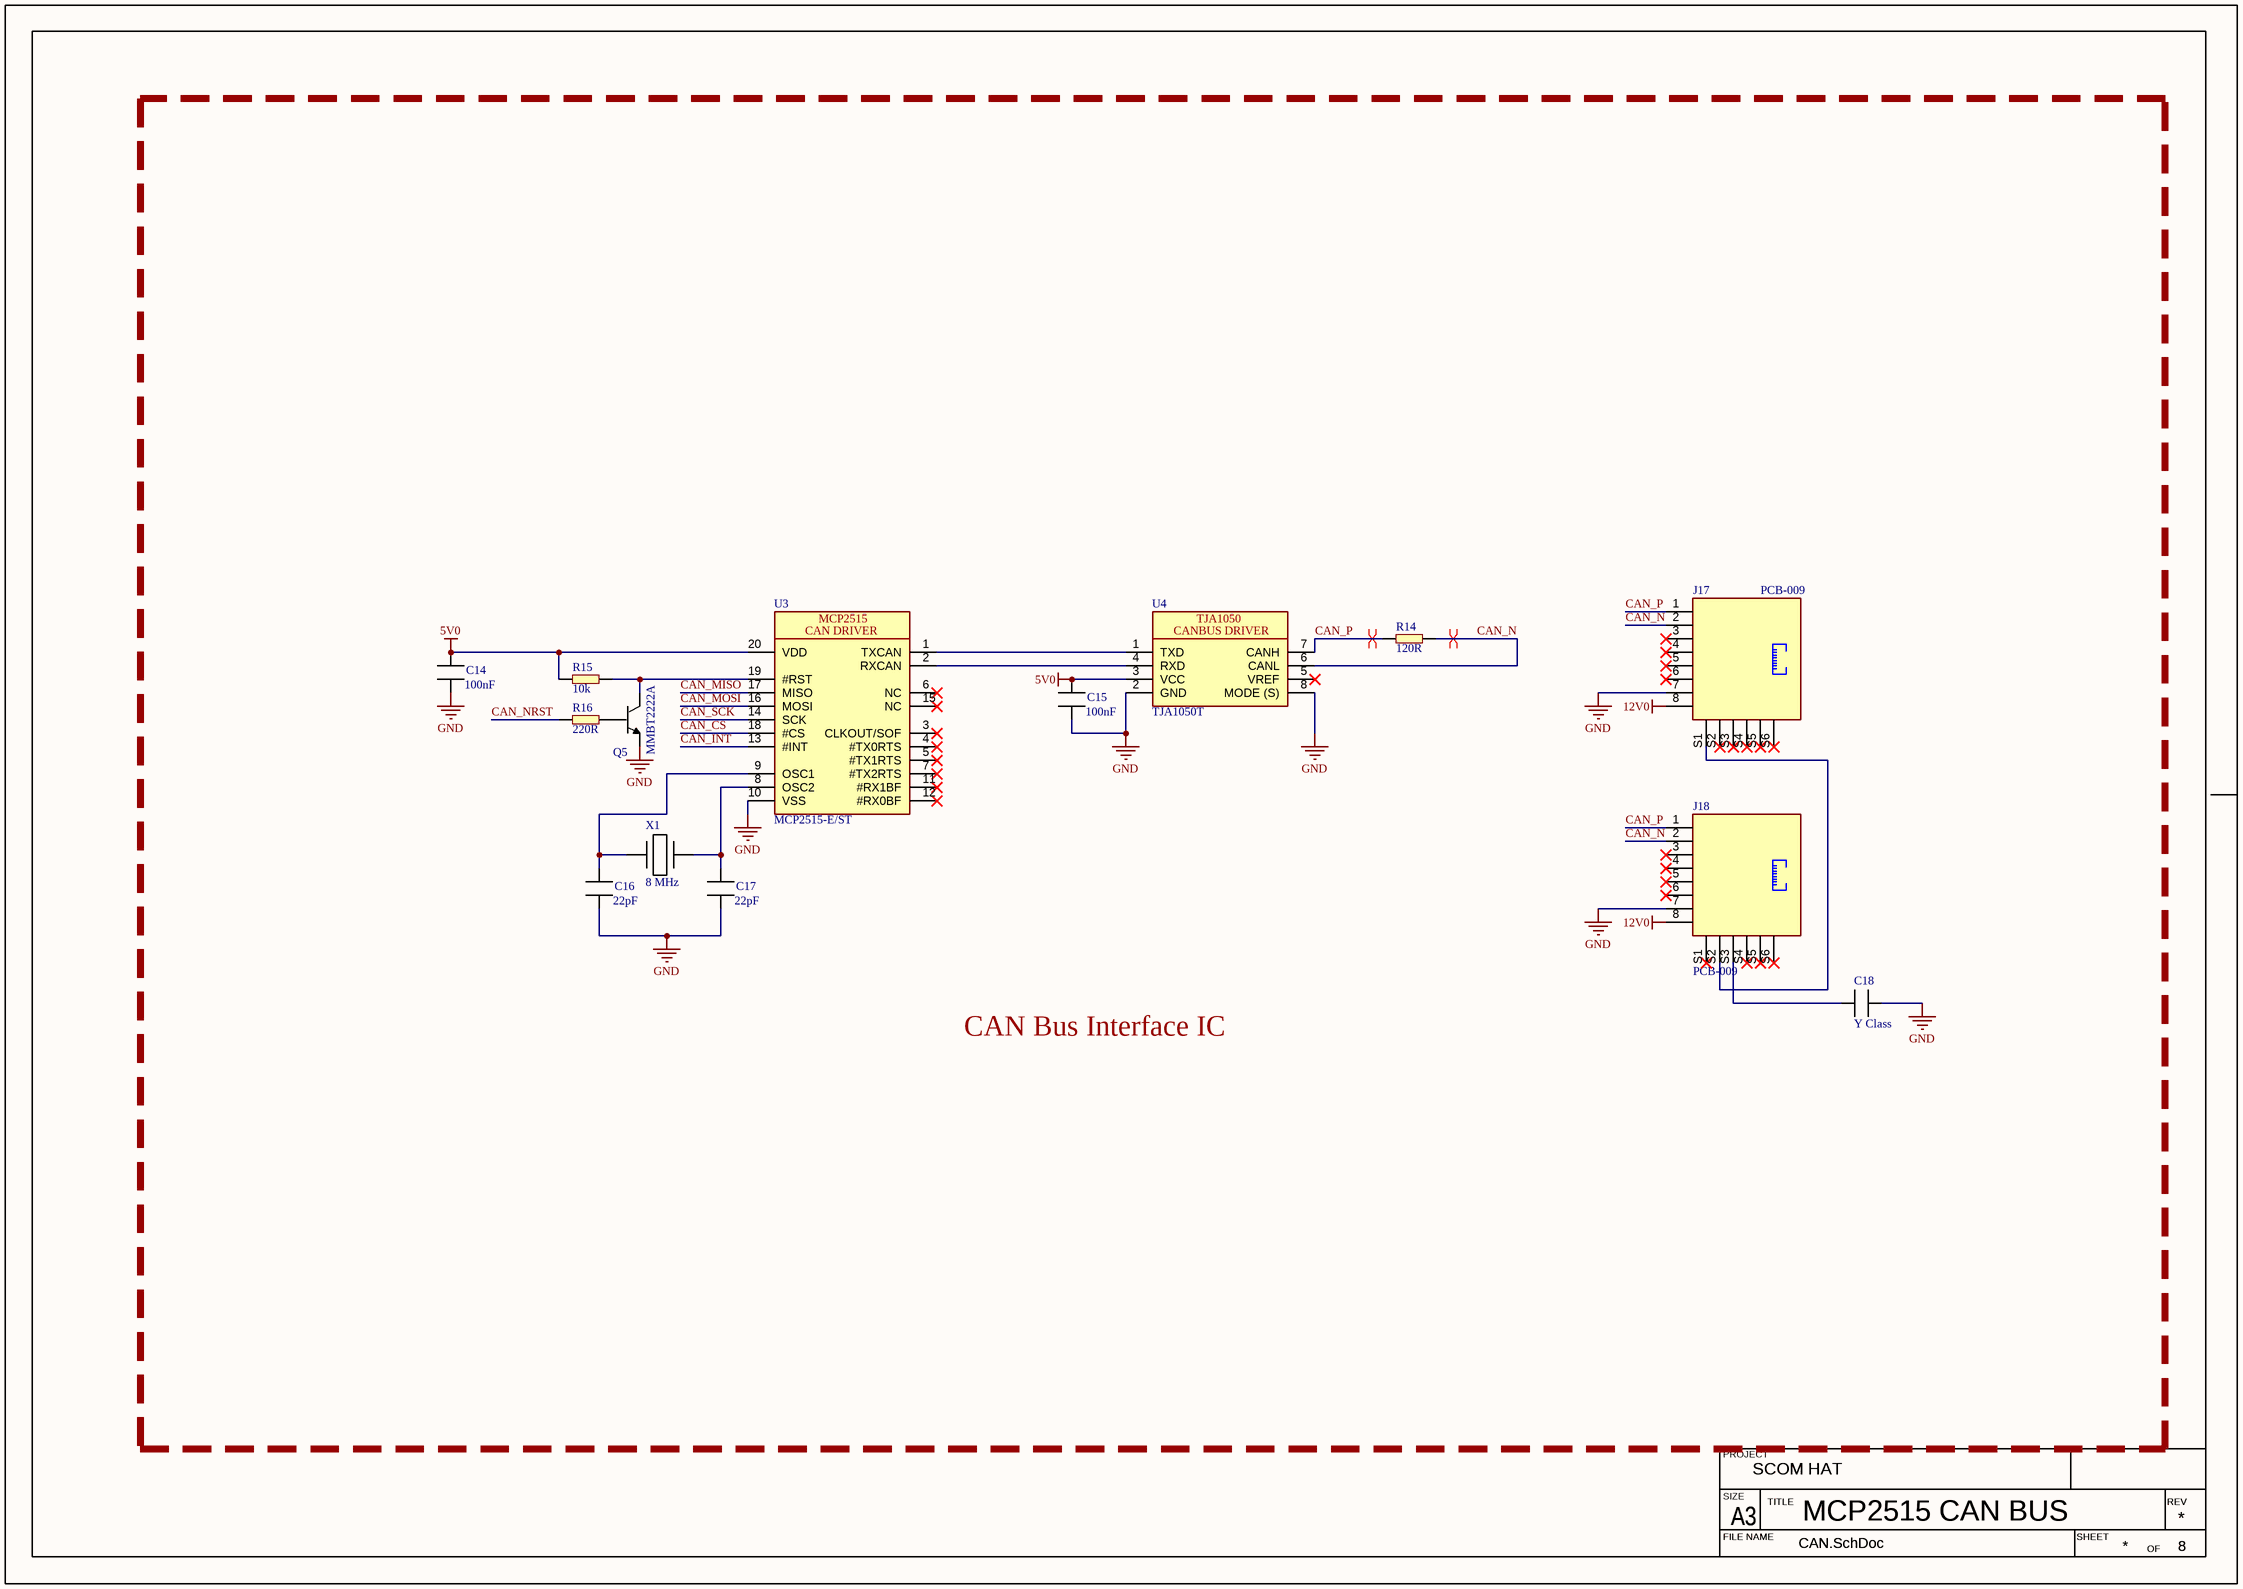
[diagram p5: CAN.SchDoc]

### Parts
C14  value 100nF  [CAPC2012X13L]  (hidden comment: MLCC_0805)
C15  value 100nF  [CAPC2012X13L]  (hidden comment: MLCC_0805)
C16  value 22pF  [CAPC2012X13L]  (hidden comment: MLCC_0805)
C17  value 22pF  [CAPC2012X13L]  (hidden comment: MLCC_0805)
C18  value Y Class  [VY1222M43Y5UC63V0]  (hidden comment: VY1)
J17  value PCB-009  [PCB-009]  (hidden comment: ERP_148-3)
J18  value PCB-009  [PCB-009]  (hidden comment: ERP_148-3)
Q5  value MMBT2222A  [MMBT2222]  (hidden comment: ERP_105-1)
R14  value 120R  [RES_0603]  (hidden comment: ERP_101-1)
R15  value 10k  [RES_0603]  (hidden comment: ERP_101-1)
R16  value 220R  [RES_0603]  (hidden comment: ERP_101-1)
U3  value MCP2515-E/ST  [MCP2515-ST]  (hidden comment: MCP2515)
U4  value TJA1050T  [TJA1050T]  (hidden comment: TJA1050)
X1  value 8 MHz  [HC-49US]  (hidden comment: HC-49US)

### Blocks framed on the sheet
CAN Bus Interface IC: C14-C18 J17 J18 Q5 R14-R16 U3 U4 X1

### Nets
5V0: C14.1 C15.1 R15.1 U3.20(VDD) U4.3(VCC)
12V0: J17.8 J18.8
GND: C14.2 C15.2 C16.2 C17.2 C18.2 J17.7 J18.7 Q5.2 U3.10(VSS) U4.2(GND) U4.8(MODE_(S))
CAN_CS: U3.18(#CS)
CAN_INT: U3.13(#INT)
CAN_MISO: U3.17(MISO)
CAN_MOSI: U3.16(MOSI)
CAN_N: J17.2 J18.2 R14.2 U4.6(CANL)
CAN_NRST: R16.1
CAN_P: J17.1 J18.1 R14.1 U4.7(CANH)
CAN_SCK: U3.14(SCK)
NetC16_1: C16.1 U3.9(OSC1) X1.1
NetC17_1: C17.1 U3.8(OSC2) X1.2
NetC18_1: C18.1 J18.S3
NetJ17_S1: J17.S1 J18.S2
NetQ5_1: Q5.1 R16.2
NetQ5_3: Q5.3 R15.2 U3.19(#RST)
NetU3_1: U3.1(TXCAN) U4.1(TXD)
NetU3_2: U3.2(RXCAN) U4.4(RXD)

Not connected (* = marked no-connect by the designer): J17 3* 4* 5* 6* S2* S3* S4* S5* S6*; J18 3* 4* 5* 6* S1* S4* S5* S6*; U3 3(CLKOUT/SOF)* 4(#TX0RTS)* 5(#TX1RTS)* 6(NC)* 7(#TX2RTS)* 11(#RX1BF)* 12(#RX0BF)* 15(NC)*; U4 5(VREF)*

### Layout directives
differential pair; differential pair class CAN_120R; rule Differential Pairs Routing [Pref Gap = 10mil    Min Gap  = 10mil    Max Gap  = 10milPref Width = 16.535mil    Min Width  = 16.535mil    Max Width  = 16.535mil]: CAN_N, CAN_P

### Notes on the sheet
- PROJECT
- SIZE
- FILE NAME
- A3
- TITLE
- SHEET
- OF
- REV
- (in symbol MCP2515) CAN DRIVER
- (in symbol TJA1050) CANBUS DRIVER

### Library data of the parts
C14-C17 = MLCC_0805: as C2 on sheet POWER; Package: 0805; Manufacturer 1: *; Manufacturer Part Number 1: *
C18 = VY1: Ceramic Capacitor Y5U (E) Radial, Disc; Manufacturer 1: *; Manufacturer Part Number 1: *
J17 J18 = RJ45_Top_Entry: PCB-009 Robu; Manufacturer Part Number 1: *; Manufacturer 1: *; Supplier Part Number 1: *; Supplier 1: *; ERP: *; Package: 8P8C
Q5 = MMBT2222: MMBT2222A; ERP: *; Suuplier Part Number 1: *; Supplier 1: *; Manufacturer Part Number 1: *; Manufacturer 1: *; Package: SOT23
R14 = RES_0603: Manufacturer Part Number 1: 560112116003; Package: 0603; Manufacturer 1: *
R15 R16 = RES_0603: Package: 0603; Manufacturer 1: *; Manufacturer Part Number 1: *
U3 = MCP2515: CAN Interface IC; Manufacturer 1: *; Manufacturer Part Number 1: *
U4 = TJA1050: CAN Transceiver IC; Manufacturer 1: *; Manufacturer Part Number 1: *
X1 = HC-49US: CRYSTAL HC-49US 2 Pin; Package: HC-49US; ERP: *; Manufacturer Part Number 1: *; Manufacturer 1: *

## Sheet POWERBUDGET.SchDoc: Power Budget
size 420 x 297 mm; Revision: 1.0; SheetNumber: 8

### Notes on the sheet
- PROJECT
- SIZE
- FILE NAME
- A3
- TITLE
- SHEET
- OF
- REV

## Nets that join several sheets
3V3: TIMER (5 pins), POWER (J4.1 J8.6 J9.6), RS485 (6 pins)
5V0: POWER (J14.2), RS485 (7 pins), LORA (5 pins), CAN (5 pins)
12V0: POWER (5 pins), RS485 (J15.8 J16.8), CAN (J17.8 J18.8)
GND: TIMER (5 pins), POWER (18 pins), RS485 (6 pins), LORA (14 pins), CAN (11 pins)
485_RX: POWER (J1.19), RS485 (Q4.2 R11.2)
485_TE: POWER (J1.20), RS485 (Q3.2 R10.2)
485_TX: POWER (J1.18), RS485 (Q2.2 R5.2)
CAN_CS: POWER (J1.14), CAN (U3.18)
CAN_INT: POWER (J1.6), CAN (U3.13)
CAN_MISO: POWER (J1.12), CAN (U3.17)
CAN_MOSI: POWER (J1.10), CAN (U3.16)
CAN_NRST: POWER (J1.16), CAN (R16.1)
CAN_SCK: POWER (J1.8), CAN (U3.14)
LORA_AUX: POWER (J1.9), LORA (M1.24)
LORA_M0: POWER (J1.17), LORA (M1.20)
LORA_M1: POWER (J1.15), LORA (M1.21)
LORA_RST: POWER (J1.7), LORA (R4.2)
LORA_RXD: POWER (J1.13), LORA (M1.22)
LORA_TXD: POWER (J1.11), LORA (M1.23)
RTC_INT: TIMER (R19.1 U5.2), POWER (J1.5)
SCL: TIMER (R18.1 U5.3), POWER (J1.3)
SDA: TIMER (R17.1 U5.4), POWER (J1.1)